# EAGLE design RV8trimRelays (EAGLE 6.4)
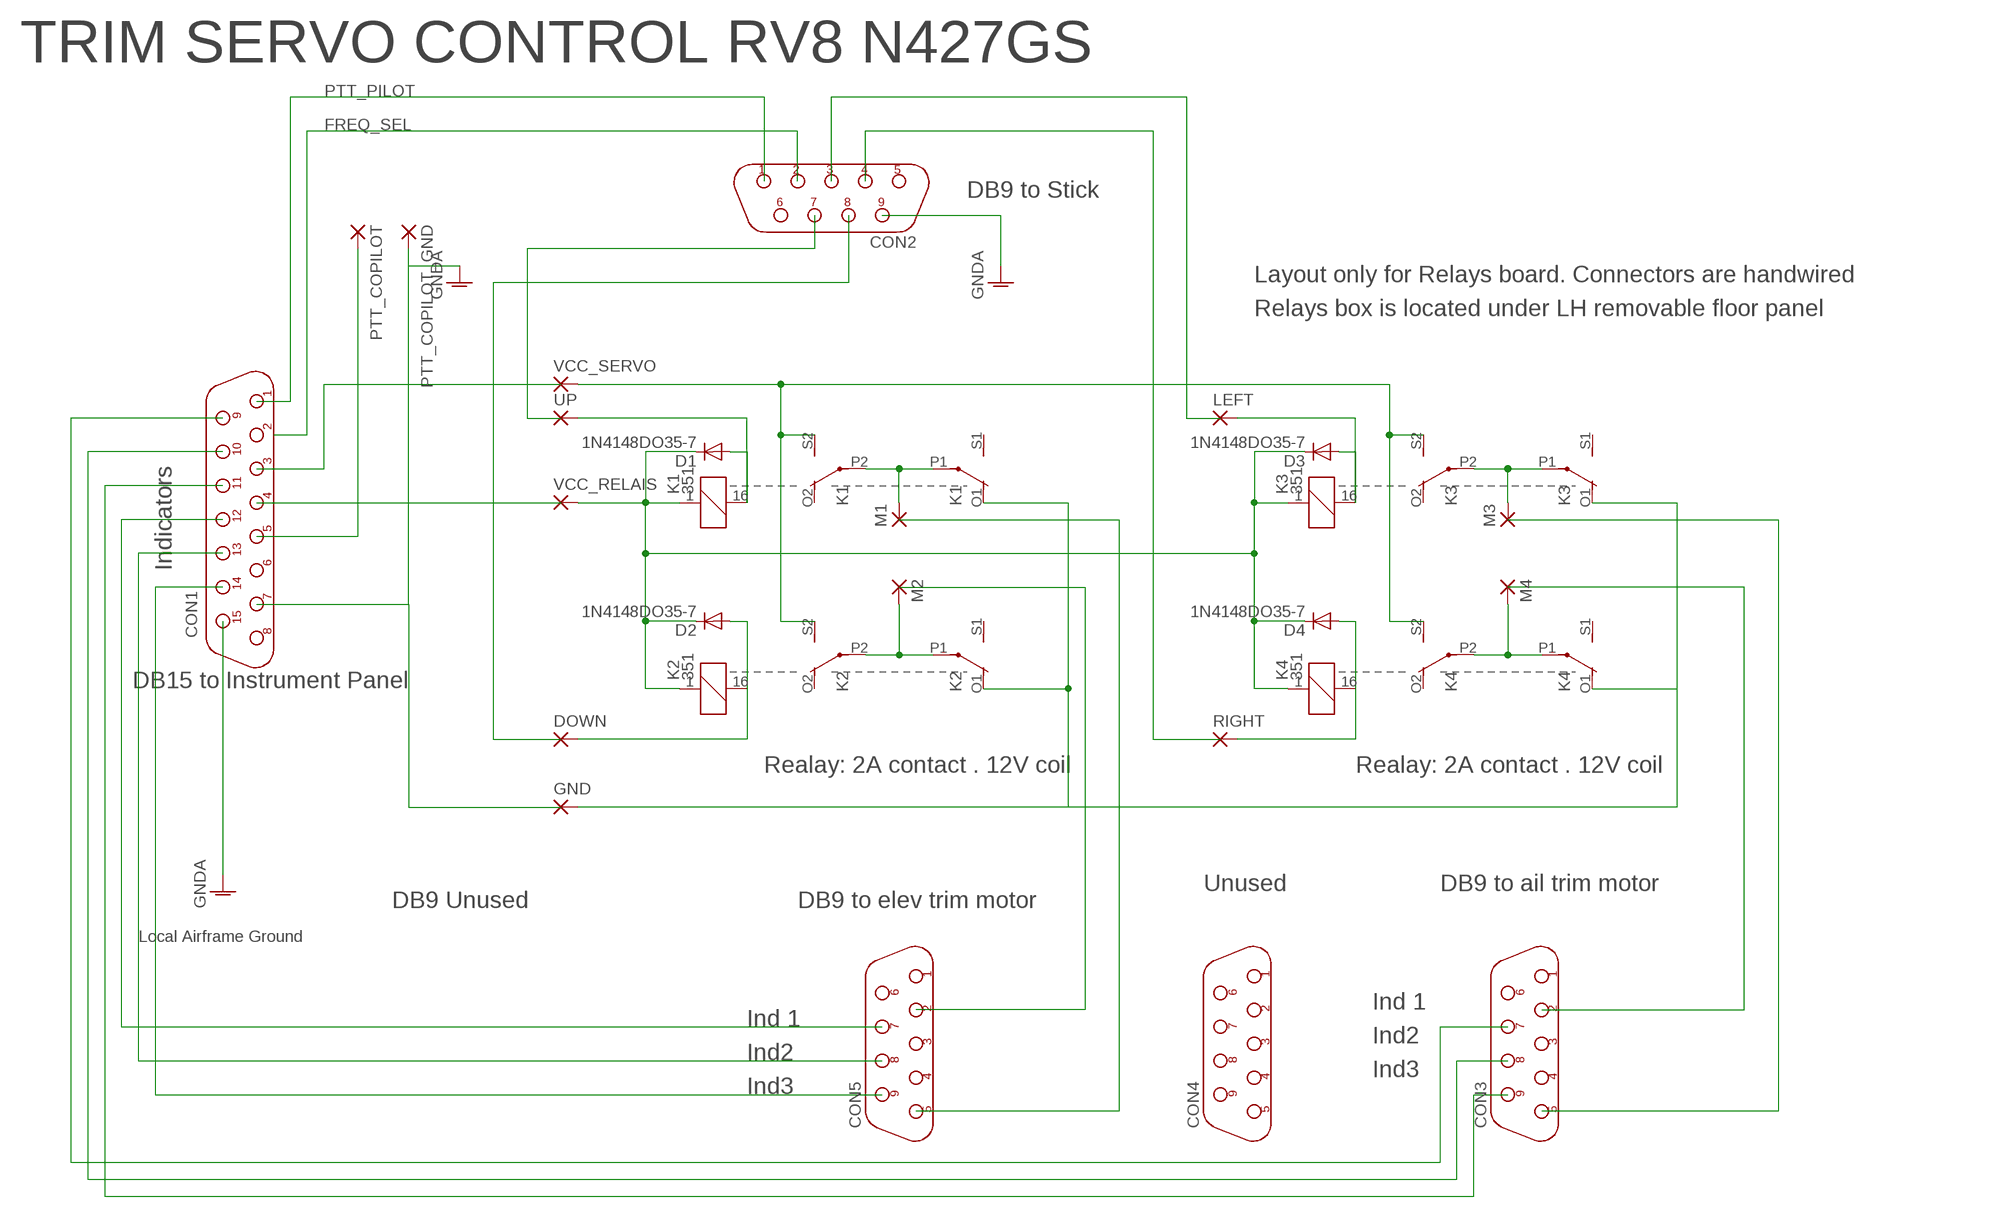
[diagram p0: schematic, sheet 1]

## Parts
CON1  DB15F  [D-15F]
CON2  DB9F  [D-09F]
CON3  DB9F  [D-09F]
CON4  DB9F  [D-09F]
CON5  DB9F  [D-09F]
D1  1N4148DO35-7  [DO35-7]
D2  1N4148DO35-7  [DO35-7]
D3  1N4148DO35-7  [DO35-7]
D4  1N4148DO35-7  [DO35-7]
DOWN  2,15/1,0  [2,15/1,0]
GND  2,15/1,0  [2,15/1,0]
K1  351  [351]
K2  351  [351]
K3  351  [351]
K4  351  [351]
LEFT  2,15/1,0  [2,15/1,0]
M1  2,15/1,0  [2,15/1,0]
M2  2,15/1,0  [2,15/1,0]
M3  2,15/1,0  [2,15/1,0]
M4  2,15/1,0  [2,15/1,0]
PTT_COPILOT  2,15/1,0  [2,15/1,0]
PTT_COPILOT_GND  2,15/1,0  [2,15/1,0]
RIGHT  2,15/1,0  [2,15/1,0]
UP  2,15/1,0  [2,15/1,0]
VCC_RELAIS  2,15/1,0  [2,15/1,0]
VCC_SERVO  2,15/1,0  [2,15/1,0]

## Nets
FREQ_SEL: CON2.2
GNDA: CON1.7 CON1.15 CON2.9 PTT_COPILOT_GND.1(P)
N$1: K2.P1(2:P) K2.P2(3:P) M2.1(P)
N$2: K1.S2(3:S) K2.S2(3:S) K3.S2(3:S) K4.S2(3:S) VCC_SERVO.1(P)
N$3: D2.A DOWN.1(P) K2.16
N$4: K1.P1(2:P) K1.P2(3:P) M1.1(P)
N$5: GND.1(P) K1.O1(2:O) K2.O1(2:O) K3.O1(2:O) K4.O1(2:O)
N$6: D1.C D2.C D3.C D4.C K1.1 K2.1 K3.1 K4.1 VCC_RELAIS.1(P)
N$7: D1.A K1.16 UP.1(P)
N$8: CON1.4
N$9: K3.P1(2:P) K3.P2(3:P) M3.1(P)
N$10: CON1.3
N$11: CON3.2
N$12: D3.A K3.16 LEFT.1(P)
N$13: K4.P1(2:P) K4.P2(3:P) M4.1(P)
N$14: D4.A K4.16 RIGHT.1(P)
N$15: CON3.5
N$16: CON5.5
N$17: CON5.2
N$18: CON1.9 CON3.7
N$19: CON1.10 CON3.8
N$20: CON1.11 CON3.9
N$21: CON1.12 CON5.7
N$22: CON1.13 CON5.8
N$23: CON1.14 CON5.9
N$24: CON2.7
N$25: CON2.8
N$26: CON2.3
N$27: CON2.4
PTT_COPILOT: CON1.5 PTT_COPILOT.1(P)
PTT_PILOT: CON1.1 CON2.1
Unconnected: CON1.2 CON1.6 CON1.8 CON2.5 CON2.6 CON3.1 CON3.3 CON3.4 CON3.6 CON4.1 CON4.2 CON4.3 CON4.4 CON4.5 CON4.6 CON4.7 CON4.8 CON4.9 CON5.1 CON5.3 CON5.4 CON5.6 K1.O2(3:O) K1.S1(2:S) K2.O2(3:O) K2.S1(2:S) K3.O2(3:O) K3.S1(2:S) K4.O2(3:O) K4.S1(2:S)

## Notes on the sheet
- TRIM SERVO CONTROL RV8 N427GS
- DB9 to Stick
- Layout only for Relays board. Connectors are handwired
- Relays box is located under LH removable floor panel
- Indicators
- DB15 to Instrument Panel
- Realay: 2A contact . 12V coil | Realay: 2A contact . 12V coil
- Unused | DB9 to ail trim motor
- DB9 Unused | DB9 to elev trim motor
- Local Airframe Ground
- Ind 1
- Ind 1
- Ind2
- Ind2
- Ind3
- Ind3

## Library data of the parts
CON1 = connect:DB15F
CON2-CON5 = connect:DB9F
D1-D4 = diode:1N4148: DIODE high speed (Philips)
DOWN GND LEFT M1-M4 PTT_COPILOT PTT_COPILOT_GND RIGHT UP VCC_RELAIS VCC_SERVO = wirepad:2,15/1,0: THROUGH-HOLE PAD
K1-K4 = relay:351: RELAY 2 x switch, Omron; OC_FARNELL: unknown; OC_NEWARK: unknown

## Board
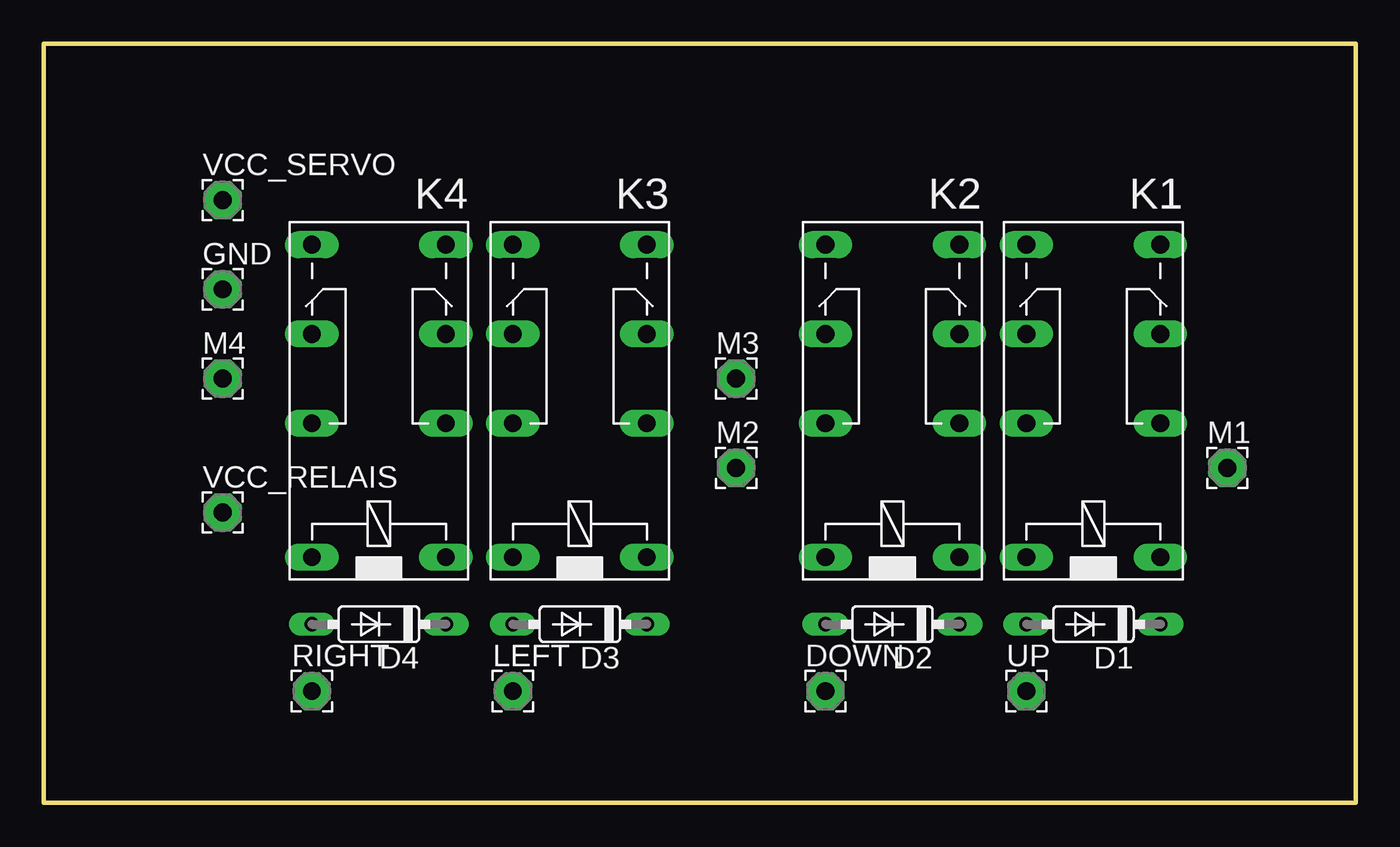
[diagram p1: board, top side]
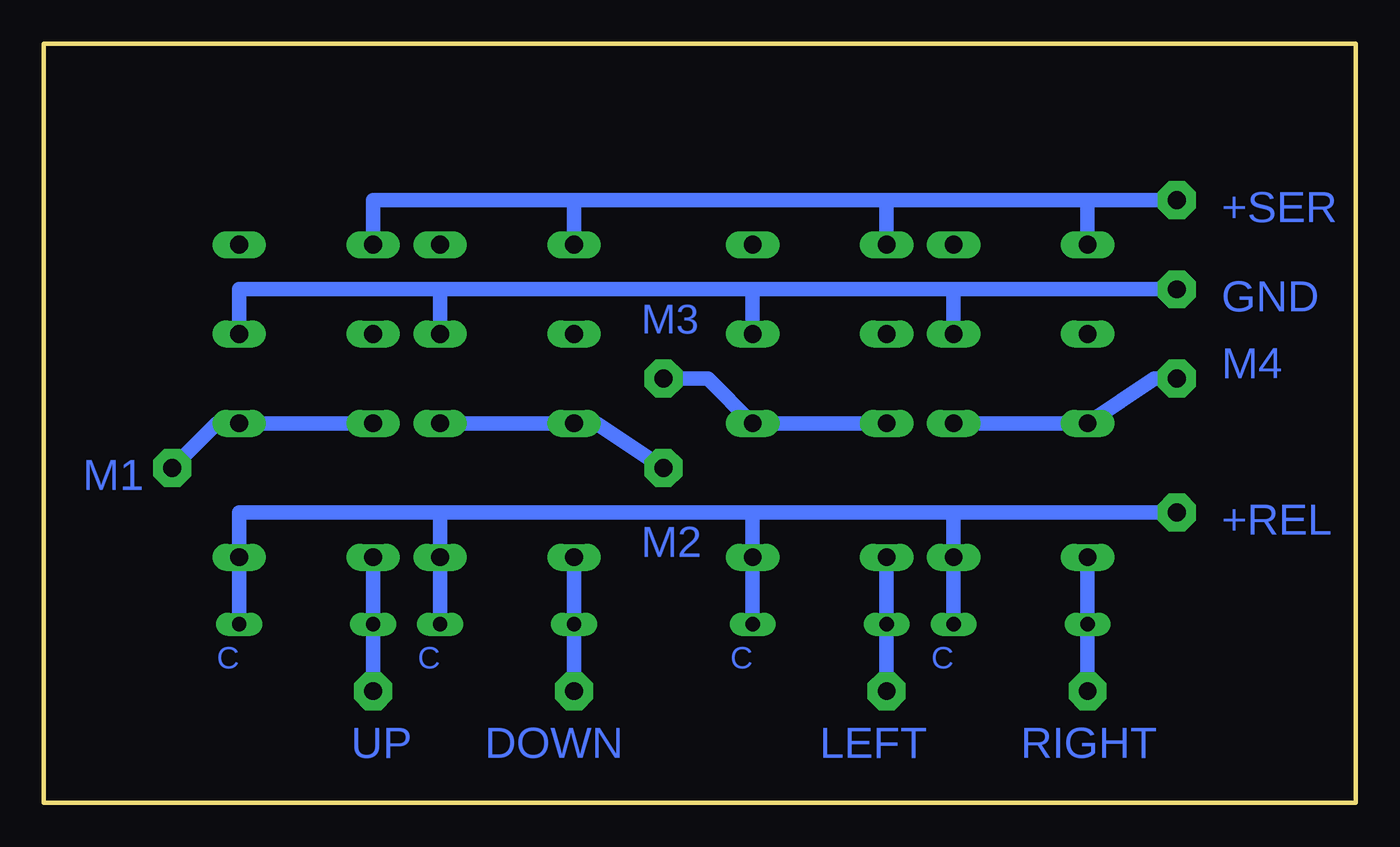
[diagram p2: board, bottom side, seen from below]

Size 74.6 x 43.17 mm. Coordinates in mm from the lower left corner, seen from the top.
Outline: 0,0 74.6,0 74.6,43.17 0,43.17 0,0
Copper layers (1*16): Top 0.035mm / dielectric 1.5mm / Bottom 0.035mm
Design rules "default": minimum track width 10mil, minimum drill 24mil, track to track 8mil, track to pad 8mil, pad to pad 8mil, via to via 8mil, smd to smd 8mil, copper to edge 40mil, drill to drill 8mil, minimum pad ring 10mil, minimum via ring 8mil, stop-mask expansion 4mil, vias tented up to drill 0mil, thermal gap 10mil

### Footprints (pad centres in the part's own frame; a part is rotated, then mirrored left to right if it is on the bottom)
D-15F = drill 1.016 pad 1.575 octagon: 1 9.779,1.397; 2 6.985,1.397; 3 4.191,1.397; 4 1.397,1.397; 5 -1.397,1.397; 6 -4.191,1.397; 7 -6.985,1.397; 8 -9.779,1.397; 9 8.382,-1.397; 10 5.588,-1.397; 11 2.794,-1.397; 12 0,-1.397; 13 -2.794,-1.397; 14 -5.588,-1.397; 15 -8.382,-1.397 | hole 4.115: 16.383,0; -16.383,0
D-09F = drill 1.016 pad 1.575 octagon: 1 5.588,1.397; 2 2.794,1.397; 3 0,1.397; 4 -2.794,1.397; 5 -5.588,1.397; 6 4.191,-1.397; 7 1.397,-1.397; 8 -1.397,-1.397; 9 -4.191,-1.397 | hole 4.115: 12.192,0; -12.192,0
DO35-7 = drill 0.813 long: A 3.81,0; C -3.81,0
2,15/1,0 = drill 1.016 pad 2.159 octagon: 1 0,0
351 = drill 1.016 long: 1 -3.81,-3.81; 16 -3.81,3.81; O1 8.89,-3.81; O2 8.89,3.81; P1 3.81,-3.81; P2 3.81,3.81; S1 13.97,-3.81; S2 13.97,3.81

### Placement (x,y rotation side)
CON1  20.32,-46.99 0 top  (outside the outline)
CON2  15.24,-63.5 0 top  (outside the outline)
CON3  15.24,-80.01 0 top  (outside the outline)
CON4  15.24,-123.19 0 top  (outside the outline)
CON5  15.24,-30.48 0 top  (outside the outline)
D1  59.69,10.16 180 top
D2  48.26,10.16 180 top
D3  30.48,10.16 180 top
D4  19.05,10.16 180 top
DOWN  44.45,6.35 0 top
GND  10.16,29.21 0 top
K1  59.69,17.78 90 top
K2  48.26,17.78 90 top
K3  30.48,17.78 90 top
K4  19.05,17.78 90 top
LEFT  26.67,6.35 0 top
M1  67.31,19.05 0 top
M2  39.37,19.05 0 top
M3  39.37,24.13 0 top
M4  10.16,24.13 0 top
PTT_COPILOT  2.54,-90.17 0 top  (outside the outline)
PTT_COPILOT_GND  2.54,-95.25 0 top  (outside the outline)
RIGHT  15.24,6.35 0 top
UP  55.88,6.35 0 top
VCC_RELAIS  10.16,16.51 0 top
VCC_SERVO  10.16,34.29 0 top

### Tracks (layer width: path | path; a pad name or v marks a point on that pad's centre or on a via)
GNDA  (3 unrouted)
N$1
  Bottom 0.813: K2.P1 K2.P2 43.18,21.59 M2.1
N$2
  Bottom 0.813: K4.S2 15.24,34.29 | 15.24,34.29 26.67,34.29 | 26.67,34.29 44.45,34.29 | 44.45,34.29 55.88,34.29 K1.S2 | K2.S2 44.45,34.29 | K3.S2 26.67,34.29 | VCC_SERVO.1 15.24,34.29
N$3
  Bottom 0.813: K2.16 D2.A DOWN.1
N$4
  Bottom 0.813: K1.P2 K1.P1 64.77,21.59 M1.1
N$5
  Bottom 0.813: GND.1 22.86,29.21 | 22.86,29.21 34.29,29.21 | 34.29,29.21 52.07,29.21 | 52.07,29.21 63.5,29.21 K1.O1 | K4.O1 22.86,29.21 | K3.O1 34.29,29.21 | K2.O1 52.07,29.21
N$6
  Bottom 0.813: D3.C K3.1 34.29,16.51 | D2.C K2.1 52.07,16.51 | D1.C K1.1 63.5,16.51 52.07,16.51 | D4.C K4.1 22.86,16.51 | 22.86,16.51 34.29,16.51 | 34.29,16.51 52.07,16.51 | 22.86,16.51 VCC_RELAIS.1
N$7
  Bottom 0.813: K1.16 D1.A UP.1
N$9
  Bottom 0.813: K3.P2 K3.P1 36.83,24.13 M3.1
N$12
  Bottom 0.813: K3.16 D3.A LEFT.1
N$13
  Bottom 0.813: K4.P1 K4.P2 11.43,24.13 M4.1
N$14
  Bottom 0.813: K4.16 D4.A RIGHT.1
N$18  (1 unrouted)
N$19  (1 unrouted)
N$20  (1 unrouted)
N$21  (1 unrouted)
N$22  (1 unrouted)
N$23  (1 unrouted)
PTT_COPILOT  (1 unrouted)
PTT_PILOT  (1 unrouted)

### Text on the board
Bottom: +SER | GND | M3 | M4 | M1 | +REL | M2 | C | C | C | C | RIGHT | LEFT | DOWN | UP